# EAGLE design Qwiic_Multi_Port_Board (EAGLE 9.5.2)
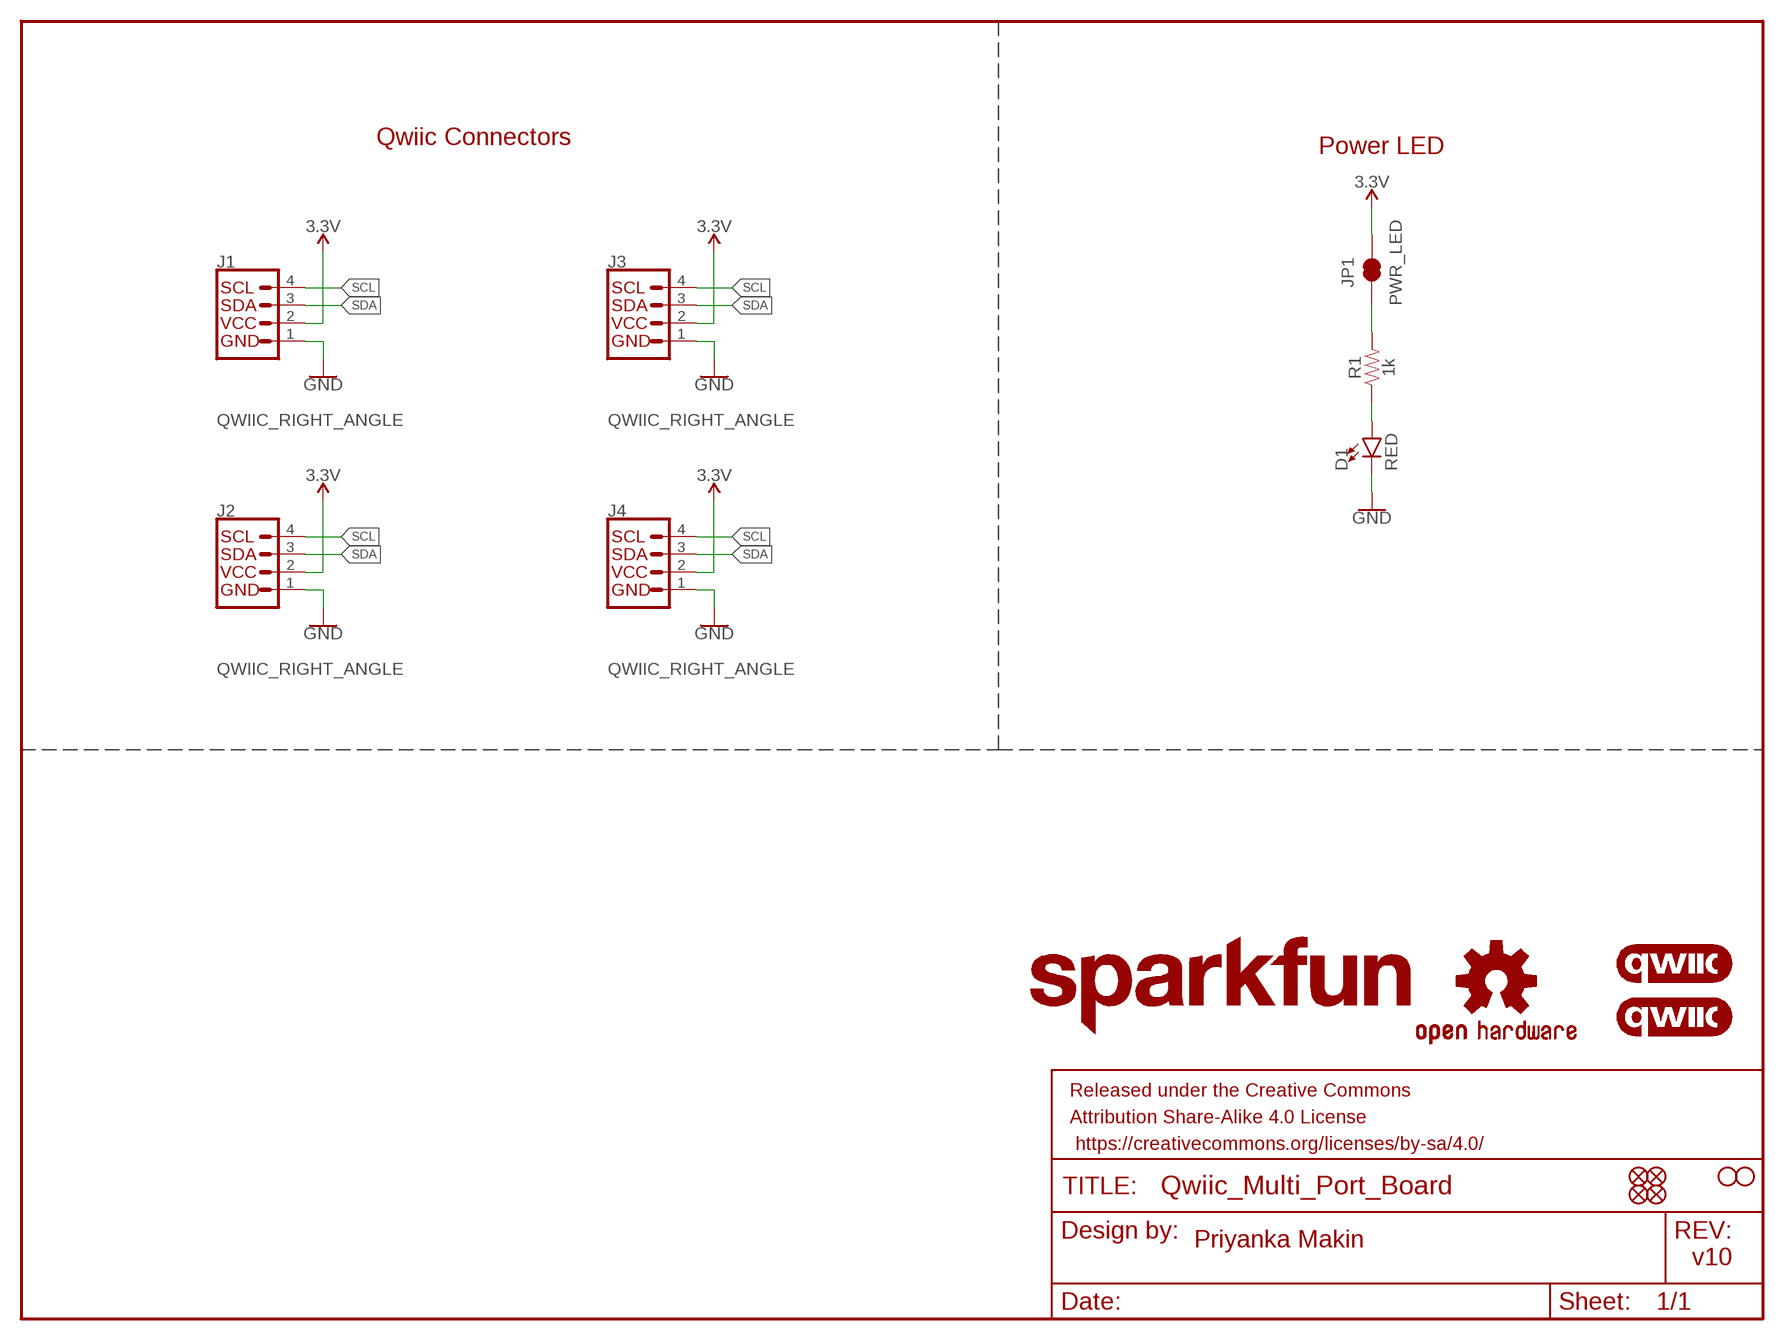
[diagram p0: schematic, sheet 1]

## Parts
D1  RED  LED-RED0603  [LED-0603]
FD1  FIDUCIAL1X2  [FIDUCIAL-1X2]
FD2  FIDUCIAL1X2  [FIDUCIAL-1X2]
FD3  FIDUCIAL1X2  [FIDUCIAL-1X2]
FD4  FIDUCIAL1X2  [FIDUCIAL-1X2]
FRAME1  FRAME-LETTER  [CREATIVE_COMMONS]
H1  STAND-OFFTIGHT  [STAND-OFF-TIGHT]
H2  STAND-OFFTIGHT  [STAND-OFF-TIGHT]
J1  QWIIC_RIGHT_ANGLE  QWIIC_CONNECTORJS-1MM  [JST04_1MM_RA]
J2  QWIIC_RIGHT_ANGLE  QWIIC_CONNECTORJS-1MM  [JST04_1MM_RA]
J3  QWIIC_RIGHT_ANGLE  QWIIC_CONNECTORJS-1MM  [JST04_1MM_RA]
J4  QWIIC_RIGHT_ANGLE  QWIIC_CONNECTORJS-1MM  [JST04_1MM_RA]
JP1  PWR_LED  JUMPER-SMT_2_NC_TRACE_SILK  [SMT-JUMPER_2_NC_TRACE_SILK]
LOGO1  QWIIC_LOGO_5MM  [QWIIC_5MM]
LOGO2  QWIIC_LOGO_5MM  [QWIIC_5MM]
LOGO3  OSHW-LOGOS  [OSHW-LOGO-S]
LOGO4  SFE_LOGO_NAME.2_INCH  [SFE_LOGO_NAME_.2]
R1  1k  1KOHM-0603-1/10W-1%  [0603]

## Nets
3.3V: J1.2 J2.2 J3.2 J4.2 JP1.2
GND: D1.C J1.1 J2.1 J3.1 J4.1
N$1: D1.A R1.1
N$2: JP1.1 R1.2
SCL: J1.4 J2.4 J3.4 J4.4
SDA: J1.3 J2.3 J3.3 J4.3

## Notes on the sheet
- Qwiic Connectors
- Power LED
- Priyanka Makin
- v10

## Library data of the parts
D1 = SparkFun-LED:LED-RED: Red SMD LED Used in manufacturing of most products at SparkFun Packages: 0603 - SMD 0603 package [Product Link] <http://docs.avagotech.com/docs/AV02-0551EN> 0603 SMART - SMD 0603 SMART package ( more efficient and expensive)[Product Link] <http://www.osram-os.com/Graphics/XPic2/00077099_0.pdf> 1206 - SMD1206 package [Product Link] <https://www.sparkfun.com/datasheets/DevTools/LilyPad/Q150OVS4.pdff> SparkFun Products: Pro Mini 328 -5V <https://www.sparkfun.com/products/821> RedBoard <https://www.sparkfun.com/products/12757> IOIO-OTG <https://www.sparkfun.com/products/13613>; PROD_ID: DIO-00819
FD1-FD4 = SparkFun-Aesthetics:FIDUCIAL: Fiducial Alignment Points Point-of-reference for pick-and-place machines and other optical instruments.
FRAME1 = SparkFun-Aesthetics:FRAME-LETTER: Schematic Frame - Letter Standard 8.5x11 US Letter frame
H1 H2 = SparkFun-Hardware:STAND-OFF: Stand Off Drill holes for mechanically mounting via screws, standoffs, etc. Note: Use the keepout ring to avoid running the screw head into surrounding components. Variant Overviews STAND-OFF - Mechanical footprint for a #4 phillips button head screw. STAND-OFF-TIGHT - Mechanical footprint for a #4 phillips button head screw, Example SparkFun Products Screw - Phillips Head (1/4", 4-40, 10 pack) <https://www.sparkfun.com/products/10453> (PRT-10453) Screw - Phillips Head (1/2", 4-40, 10 pack) <https://www.sparkfun.com/products/10452> (PRT-10452) Screw - Phillips Head (3/4", 4-40, 10 pack) <https://www.sparkfun.com/products/10451> (PRT-10451) Screw - Phillips Head (1", 4-40, 10 pack) <https://www.sparkfun.com/products/10450> (PRT-10450)
J1-J4 = SparkFun-Connectors:QWIIC_CONNECTOR: SparkFun I2C Standard Qwiic Connector An SMD 1mm pitch JST connector makes it easy and quick (get it? Qwiic?) to connect I2C devices to each other. The Qwiic system <http://www.sparkfun.com/qwiic> enables fast and solderless connection between popular platforms and various sensors and actuators. We carry 200mm <https://www.sparkfun.com/products/14204>, 100mm <https://www.sparkfun.com/products/14205>, 50mm <https://www.sparkfun.com/products/14206>, and breadboard friendly <https://www.sparkfun.com/products/14207> Qwiic cables. We also offer 10 pcs strips <https://www.sparkfun.com/products/14323> the SMD connectors.; PROD_ID: CONN-13694
JP1 = SparkFun-Jumpers:JUMPER-SMT_2_NC_TRACE: Normally closed trace jumper This jumper has a trace between two pads so it's normally closed (NC). Use a razor knife to open the connection. For best results follow the IPC guidelines for cutting traces: Cutout at least 0.063 mm (0.005 in). Remove all loose material to clean up the cut area. Seal the cut with an approved epoxy. Reapply solder to reclose the connection.
LOGO1 LOGO2 = SparkFun-Aesthetics:QWIIC_LOGO: Qwiic Logos for placement on schematic and PCB. The 5.5mm silk logo is best for placing next to Qwiic connector.
LOGO3 = SparkFun-Aesthetics:OSHW-LOGO: Open-Source Hardware (OSHW) Logo This logo indicates the piece of hardware it is found on incorporates a OSHW license and/or adheres to the definition of open source hardware found here: http://freedomdefined.org/OSHW
LOGO4 = SparkFun-Aesthetics:SFE_LOGO_NAME: SparkFun Font Logo This is the SparkFun name logo. The logo on the schematic will always be the same size; the package variant is the height of the flame part of the logo (or the height the flame would be, if it were drawn). Default layer for the logo on the board is tSilk.
R1 = SparkFun-Resistors:1KOHM: 1kΩ resistor A resistor is a passive two-terminal electrical component that implements electrical resistance as a circuit element. Resistors act to reduce current flow, and, at the same time, act to lower voltage levels within circuits. - Wikipedia; PROD_ID: RES-07856

## Board
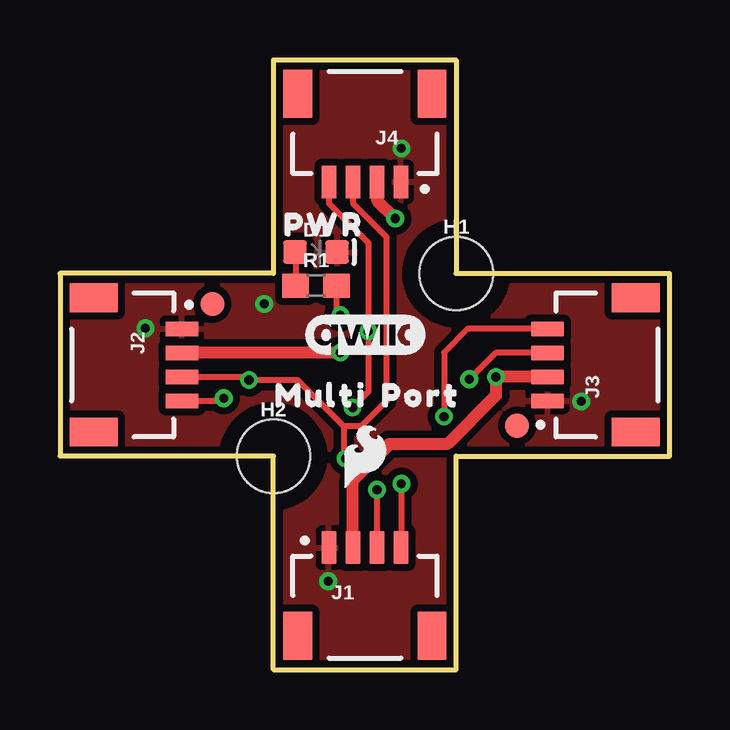
[diagram p1: board, top side]
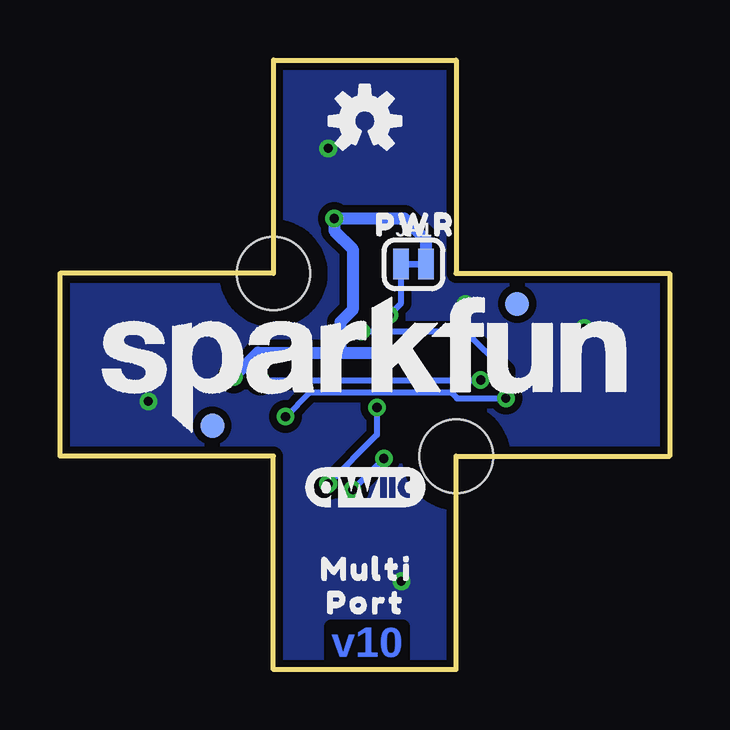
[diagram p2: board, bottom side, seen from below]

Size 25.4 x 25.4 mm. Coordinates in mm from the lower left corner, seen from the top.
Outline: 8.89,0 16.51,0 16.51,8.89 25.4,8.89 25.4,16.51 16.51,16.51 16.51,25.4 8.89,25.4 8.89,16.51 0,16.51 0,8.89 8.89,8.89 8.89,0
Copper layers (1*16): Top 0.035mm / dielectric 1.5mm / Bottom 0.035mm
Design rules "SparkFun-2-Layer-General-JLCPCB": minimum track width 7mil, minimum drill 0.3mm, track to track 7mil, track to pad 7mil, pad to pad 7mil, via to via 7mil, smd to smd 7mil, copper to edge 7mil, drill to drill 7mil, minimum pad ring 7mil, minimum via ring 7mil, stop-mask expansion 3mil, vias tented up to drill 25mil, thermal gap 10mil

### Footprints (pad centres in the part's own frame; a part is rotated, then mirrored left to right if it is on the bottom)
LED-0603 = smd 1 x 1: A -0.877,0; C 0.877,0
FIDUCIAL-1X2 = smd 1 x 1: 1 0,0
STAND-OFF-TIGHT = hole 3.048: 0,0
JST04_1MM_RA = smd 0.6 x 1.35: 1 -1.5,0; 2 -0.5,0; 3 0.5,0; 4 1.5,0 | smd 1.2 x 2: NC1 2.8,-3.675; NC2 -2.8,-3.675
SMT-JUMPER_2_NC_TRACE_SILK = smd 0.66 x 1.27: 1 -0.521,0; 2 0.521,0
0603 = smd 1.1 x 1: 1 -0.85,0; 2 0.85,0

### Placement (x,y rotation side)
D1  10.67,17.4 0 top
FD1  6.35,15.24 0 bottom
FD2  6.35,15.24 0 top
FD3  19.05,10.16 0 top
FD4  19.05,10.16 0 bottom
FRAME1  21.59,-8.89 0 top  (outside the outline)
H1  16.51,16.51 0 top
H2  8.89,8.89 0 top
J1  12.7,5.08 0 top
J2  5.08,12.7 270 top
J3  20.32,12.7 90 top
J4  12.7,20.32 180 top
JP1  10.67,16.89 0 bottom
LOGO1  12.7,13.97 0 top
LOGO2  12.7,7.62 0 bottom
LOGO3  12.7,22.86 0 bottom
LOGO4  12.7,12.7 0 bottom
R1  10.67,16 0 top
U$1  [PWR0]  8.64,18.54 0 top
U$2  [SFE_LOGO_FLAME_.1]  12.7,8.89 0 top
U$3  [PWR0]  12.95,18.54 0 bottom
U$9  [PWR0]  8.64,18.54 0 top
U$10  [MULTI0]  8.26,11.43 0 top
U$11  [MULTI0]  15.24,4.19 0 bottom
U$12  [PORT0]  12.7,11.43 0 top
U$13  [PORT0]  14.99,2.79 0 bottom

### Tracks (layer width: path | path; a pad name or v marks a point on that pad's centre or on a via)
3.3V  (via drill 0.38)
  Top 0.254: v18.17,12.2 v18.16,12.19
  Top 0.508: v18.16,12.19 18.16,11.43 16.13,9.4 13.72,9.4 12.2,7.88 J1.2 | v11.68,13.21 v11.68,13.2 J2.2 | J4.2 13.2,19.56 v13.96,18.8 v13.97,18.8 | J3.2 v18.17,12.2
  Bottom 0.508: 13.72,13.21 17.14,13.21 v18.16,12.19 | 13.72,13.21 v11.68,13.21 | 13.72,13.21 13.72,14.48 13.21,14.99 13.21,17.53 13.97,18.29 v13.97,18.8 11.05,18.8 10.15,17.89 JP1.2
GND  (via drill 0.38)
  other vias: 11.18,3.68 3.56,14.22 14.22,21.72 21.72,11.18 8.51,15.24
  pour Top (isolate 0.305): 0,16.51 0,8.89 8.89,8.89 8.89,0 16.51,0 16.51,8.89 25.4,8.89 25.4,16.51 16.51,16.51 16.51,25.4 8.89,25.4 8.89,16.51
  pour Bottom (isolate 0.305): 0,16.51 0,8.89 8.89,8.89 8.89,0 16.51,0 16.51,8.89 25.4,8.89 25.4,16.51 16.51,16.51 16.51,25.4 8.89,25.4 8.89,16.51
N$1
  Top 0.254: D1.A 9.82,17.37 R1.1
N$2  (via drill 0.38)
  Top 0.254: R1.2 11.52,14.94 v11.68,14.77
  Bottom 0.254: v11.68,14.77 11.19,15.27 JP1.1
SCL  (via drill 0.38)
  Top 0.254: v16,10.54 16,13.21 16.99,14.2 J3.4 | J4.4 11.2,19.43 12.85,17.78 v12.85,14.1 12.85,11.58 v12.19,10.92 | v14.22,7.75 14.22,5.1 J1.4 | J2.4 6.72,11.2 v6.82,11.3
  Bottom 0.254: v12.19,10.92 12.19,9.78 v14.22,7.75 | v12.85,14.1 8.51,14.1 6.86,12.45 6.86,11.34 v6.82,11.3 8.85,11.3 9.11,11.56 14.99,11.56 v16,10.54
SDA  (via drill 0.38)
  Top 0.254: v13.21,7.49 J1.3 | J2.3 7.74,12.2 v7.87,12.06 9.91,12.06 11.81,10.16 11.82,10.16 | J4.3 12.2,19.43 13.6,18.03 13.6,11.18 12.58,10.16 11.82,10.16 | 11.82,10.16 11.82,8.88 v11.91,8.79 | J3.3 18.15,13.2 v17.05,12.1
  Bottom 0.254: v7.87,12.06 17.02,12.06 v17.05,12.1 | v11.91,8.79 v13.21,7.49

### Text on the board
Bottom: v10
Measures: in | in
tDocu: Priyanka Makin